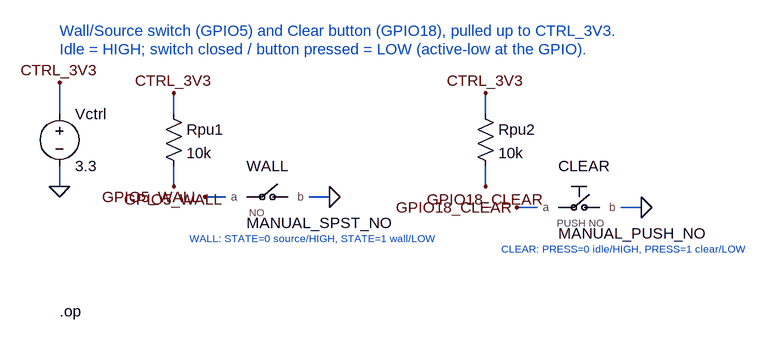
[diagram p0: schematic switches_buttons.asc]
switches_buttons.asc, the LTspice schematic file:
Version 4
SHEET 1 880 600
WIRE -160 -32 -160 16
WIRE -160 96 -160 128
WIRE 16 -16 16 16
WIRE 16 96 16 128
WIRE 64 144 96 144
WIRE 224 144 256 144
WIRE 496 -16 496 16
WIRE 496 96 496 128
WIRE 544 160 576 160
WIRE 704 160 736 160
FLAG -160 -32 CTRL_3V3
FLAG -160 128 0
FLAG 16 -16 CTRL_3V3
FLAG 16 128 GPIO5_WALL
FLAG 64 144 GPIO5_WALL
FLAG 256 144 0
FLAG 496 -16 CTRL_3V3
FLAG 496 128 GPIO18_CLEAR
FLAG 544 160 GPIO18_CLEAR
FLAG 736 160 0
SYMBOL voltage -160 0 R0
SYMATTR InstName Vctrl
SYMATTR Value 3.3
SYMBOL res 0 0 R0
SYMATTR InstName Rpu1
SYMATTR Value 10k
SYMBOL res 480 0 R0
SYMATTR InstName Rpu2
SYMATTR Value 10k
SYMBOL MANUAL_SPST_NO 160 144 R0
SYMATTR InstName WALL
SYMATTR SpiceLine STATE=0
SYMBOL MANUAL_PUSH_NO 640 152 R0
SYMATTR InstName CLEAR
SYMATTR SpiceLine PRESS=0
TEXT -160 -112 Left 2 ;Wall/Source switch (GPIO5) and Clear button (GPIO18), pulled up to CTRL_3V3.
TEXT -160 -84 Left 2 ;Idle = HIGH; switch closed / button pressed = LOW (active-low at the GPIO).
TEXT 40 208 Left 1 ;WALL: STATE=0 source/HIGH, STATE=1 wall/LOW
TEXT 520 224 Left 1 ;CLEAR: PRESS=0 idle/HIGH, PRESS=1 clear/LOW
TEXT -160 320 Left 2 !.op

The netlist it stands for:
* switches_buttons.asc
Vctrl CTRL_3V3 0 3.3
Rpu1 CTRL_3V3 GPIO5_WALL 10k
Rpu2 CTRL_3V3 GPIO18_CLEAR 10k
XWALL GPIO5_WALL 0 MANUAL_SPST_NO STATE=0  ; pins a b
XCLEAR GPIO18_CLEAR 0 MANUAL_PUSH_NO PRESS=0  ; pins a b
* Wall/Source switch (GPIO5) and Clear button (GPIO18), pulled up to CTRL_3V3.
* Idle = HIGH; switch closed / button pressed = LOW (active-low at the GPIO).
* WALL: STATE=0 source/HIGH, STATE=1 wall/LOW
* CLEAR: PRESS=0 idle/HIGH, PRESS=1 clear/LOW
.op
.lib ManualSwitch.lib
.backanno
.end